# EAGLE design Baseboard_RP2040 (EAGLE 9.5.2)
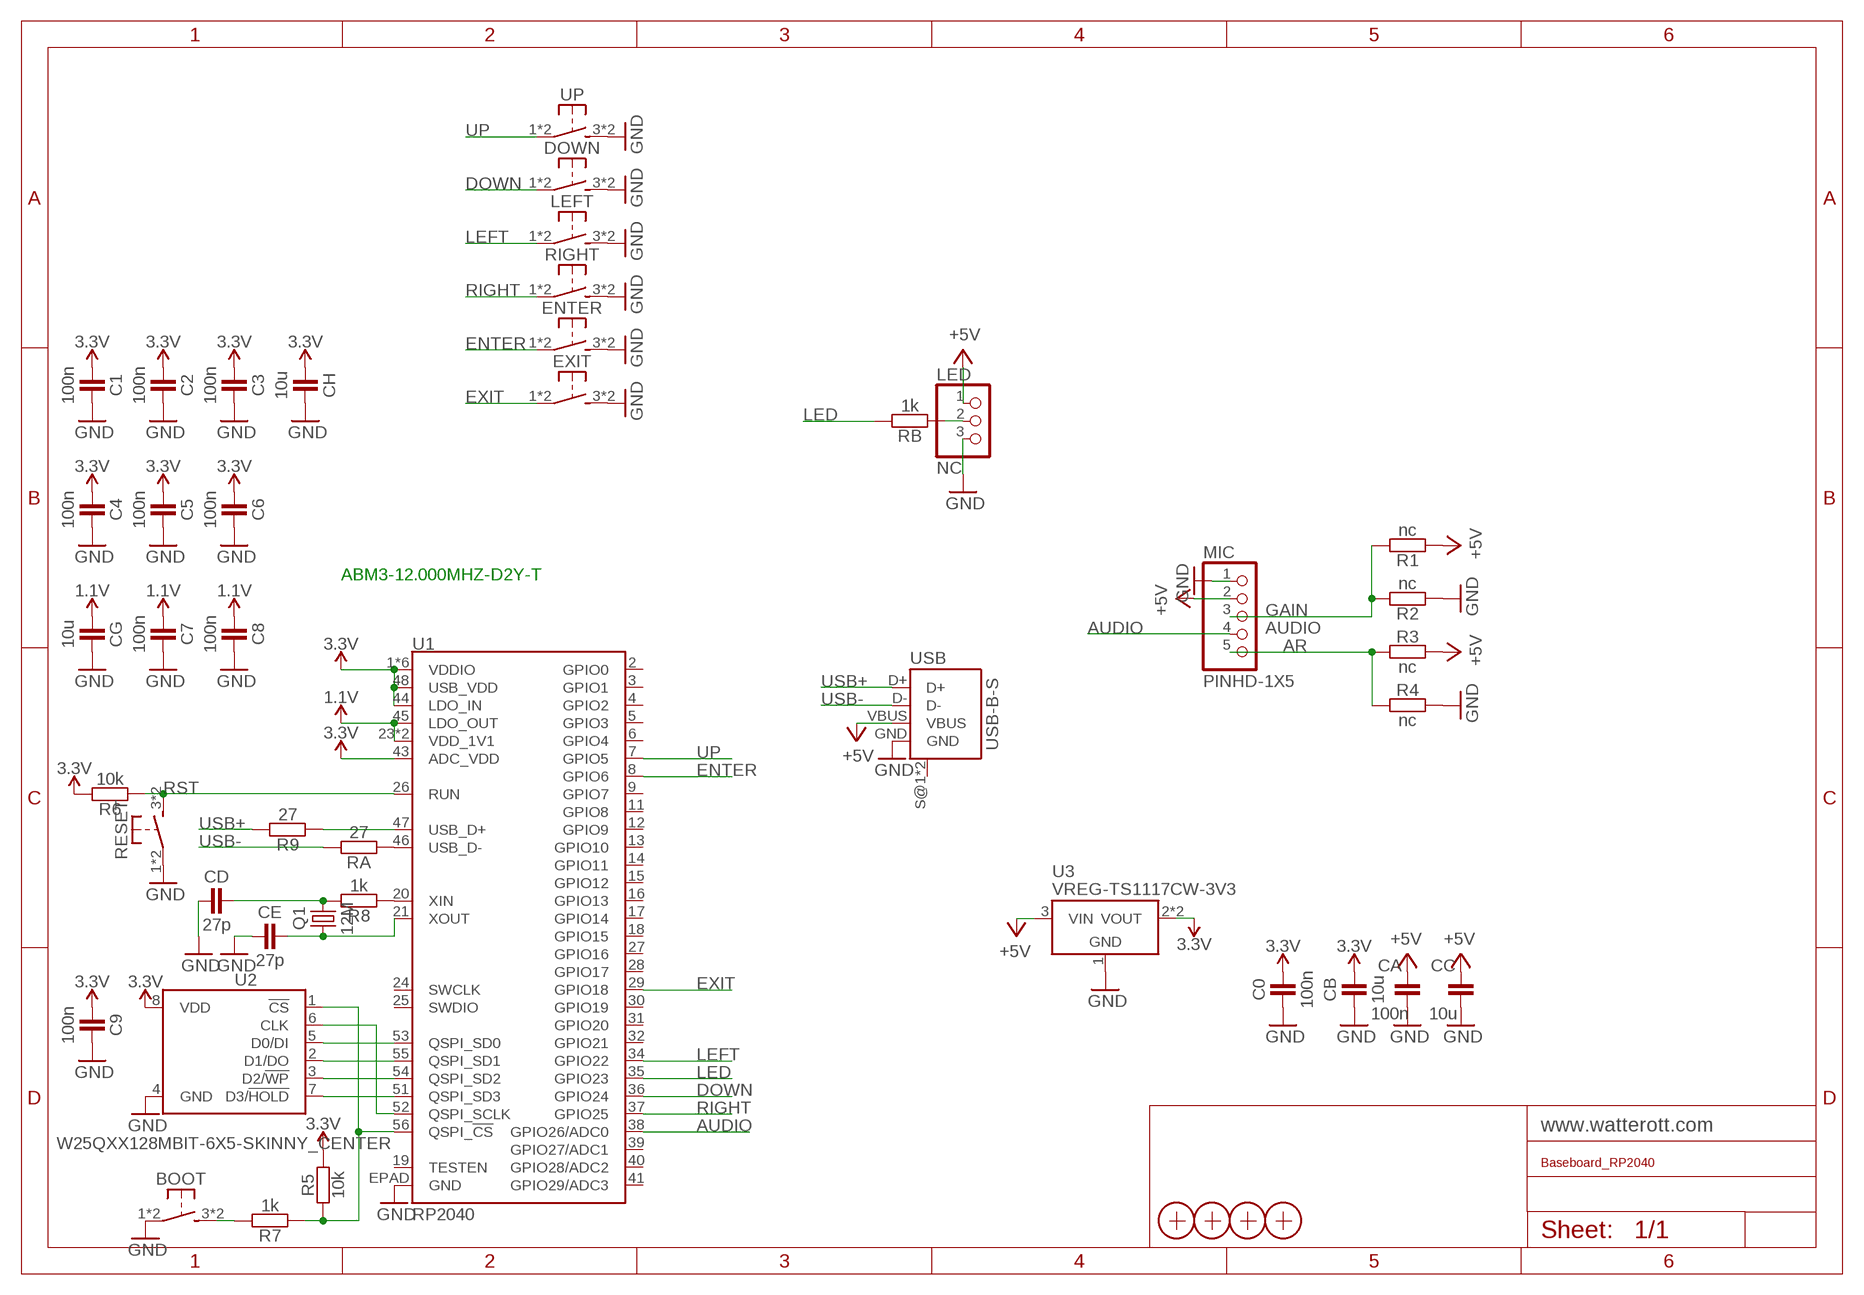
[diagram p0: schematic, sheet 1]

## Parts
BOOT  SW-TACTILE-6X6_SMD  [SW6X6_SMD]
C0  100n  CAPACITOR-0603  [C0603]
C1  100n  CAPACITOR-0603  [C0603]
C2  100n  CAPACITOR-0603  [C0603]
C3  100n  CAPACITOR-0603  [C0603]
C4  100n  CAPACITOR-0603  [C0603]
C5  100n  CAPACITOR-0603  [C0603]
C6  100n  CAPACITOR-0603  [C0603]
C7  100n  CAPACITOR-0603  [C0603]
C8  100n  CAPACITOR-0603  [C0603]
C9  100n  CAPACITOR-0603  [C0603]
CA  100n  CAPACITOR-0603  [C0603]
CB  10u  CAPACITOR-0603  [C0603]
CC  10u  CAPACITOR-0603  [C0603]
CD  27p  CAPACITOR-0603  [C0603]
CE  27p  CAPACITOR-0603  [C0603]
CG  10u  CAPACITOR-0603  [C0603]
CH  10u  CAPACITOR-0603  [C0603]
DOWN  SW-TACTILE-6X6_SMD  [SW6X6_SMD]
ENTER  SW-TACTILE-6X6_SMD  [SW6X6_SMD]
EXIT  SW-TACTILE-6X6_SMD  [SW6X6_SMD]
LED  NC  PINHD-1X3  [1X03]
LEFT  SW-TACTILE-6X6_SMD  [SW6X6_SMD]
MIC  PINHD-1X5  [1X05]
Q1  12M  CRYSTAL-CC2  [CRYSTAL_CC2]
R1  nc  RESISTOR-0603  [C0603]
R2  nc  RESISTOR-0603  [C0603]
R3  nc  RESISTOR-0603  [C0603]
R4  nc  RESISTOR-0603  [C0603]
R5  10k  RESISTOR-0603  [C0603]
R6  10k  RESISTOR-0603  [C0603]
R7  1k  RESISTOR-0603  [C0603]
R8  1k  RESISTOR-0603  [C0603]
R9  27  RESISTOR-0603  [C0603]
RA  27  RESISTOR-0603  [C0603]
RB  1k  RESISTOR-0603  [C0603]
RESET  SW-TACTILE-6X6_SMD  [SW6X6_SMD]
RIGHT  SW-TACTILE-6X6_SMD  [SW6X6_SMD]
U1  RP2040  [QFN-56]
U2  W25QXX128MBIT-6X5-SKINNY_CENTER  [WSON-8-6X5-SKINNY_CENTERPAD]
U3  VREG-TS1117CW-3V3  [SOT223]
UP  SW-TACTILE-6X6_SMD  [SW6X6_SMD]
USB  USB-B-S  [USB-B-S]
X1  PASSER-07  [PASSER_07MM]
X2  PASSER-07  [PASSER_07MM]
X3  PASSER-07  [PASSER_07MM]
X4  PASSER-07  [PASSER_07MM]

## Nets
1.1V: C7.1 C8.1 CG.1 U1.23(VDD_1V1) U1.45(LDO_OUT) U1.50(VDD_1V1)
3.3V: C0.2 C1.1 C2.1 C3.1 C4.1 C5.1 C6.1 C9.1 CB.2 CH.1 R5.2 R6.2 U1.1(VDDIO) U1.10(VDDIO) U1.22(VDDIO) U1.33(VDDIO) U1.42(VDDIO) U1.43(ADC_VDD) U1.44(LDO_IN) U1.48(USB_VDD) U1.49(VDDIO) U2.8(VDD) U3.2(VOUT) U3.4(VOUT)
+5V: CA.2 CC.2 LED.1 MIC.2 R1.1 R3.2 U3.3(VIN) USB.VBUS
AR: MIC.5 R3.1 R4.1
AUDIO: MIC.4 U1.38(GPIO26/ADC0)
DOWN: DOWN.1 DOWN.2(P1) U1.36(GPIO24)
ENTER: ENTER.1 ENTER.2(P1) U1.8(GPIO6)
EXIT: EXIT.1 EXIT.2(P1) U1.29(GPIO18)
GAIN: MIC.3 R1.2 R2.2
GND: BOOT.1 BOOT.2(P1) C0.1 C1.2 C2.2 C3.2 C4.2 C5.2 C6.2 C7.2 C8.2 C9.2 CA.1 CB.1 CC.1 CD.1 CE.1 CG.2 CH.2 DOWN.3(S1) DOWN.4(S1) ENTER.3(S1) ENTER.4(S1) EXIT.3(S1) EXIT.4(S1) LED.3 LEFT.3(S1) LEFT.4(S1) MIC.1 R2.1 R4.2 RESET.1 RESET.2(P1) RIGHT.3(S1) RIGHT.4(S1) U1.EPAD(GND) U2.4(GND) U3.1(GND) UP.3(S1) UP.4(S1) USB.GND
LED: RB.2 U1.35(GPIO23)
LEFT: LEFT.1 LEFT.2(P1) U1.34(GPIO22)
N$16: LED.2 RB.1
N$17: U1.53(QSPI_SD0) U2.5(D0/DI)
N$18: U1.55(QSPI_SD1) U2.2(D1/DO)
N$19: U1.54(QSPI_SD2) U2.3(D2/!WP!)
N$20: U1.51(QSPI_SD3) U2.7(D3/!HOLD!)
N$21: U1.52(QSPI_SCLK) U2.6(CLK)
N$22: R5.1 R7.1 U1.56(QSPI_!CS!) U2.1(!CS!)
N$23: BOOT.3(S1) BOOT.4(S1) R7.2
N$24: R8.1 U1.20(XIN)
N$25: CD.2 Q1.2 R8.2
N$26: CE.2 Q1.1 U1.21(XOUT)
N$28: R9.1 U1.47(USB_D+)
N$29: RA.1 U1.46(USB_D-)
RIGHT: RIGHT.1 RIGHT.2(P1) U1.37(GPIO25)
RST: R6.1 RESET.3(S1) RESET.4(S1) U1.26(RUN)
UP: U1.7(GPIO5) UP.1 UP.2(P1)
USB+: R9.2 USB.D+
USB-: RA.2 USB.D-
Unconnected: U1.2(GPIO0) U1.3(GPIO1) U1.4(GPIO2) U1.5(GPIO3) U1.6(GPIO4) U1.9(GPIO7) U1.11(GPIO8) U1.12(GPIO9) U1.13(GPIO10) U1.14(GPIO11) U1.15(GPIO12) U1.16(GPIO13) U1.17(GPIO14) U1.18(GPIO15) U1.19(TESTEN) U1.24(SWCLK) U1.25(SWDIO) U1.27(GPIO16) U1.28(GPIO17) U1.30(GPIO19) U1.31(GPIO20) U1.32(GPIO21) U1.39(GPIO27/ADC1) U1.40(GPIO28/ADC2) U1.41(GPIO29/ADC3) USB.S@1(SHIELD) USB.S@2(SHIELD)

## Notes on the sheet
- ABM3-12.000MHZ-D2Y-T

## Library data of the parts
BOOT DOWN ENTER EXIT LEFT RESET RIGHT UP = we-switch:SW-TACTILE: Tactile Switche
C0 C1-C9 CA CB CC CD CE CG CH = we-rcl:CAPACITOR: Capacitor ...2.2uF @ 6.3V -> 0402 ...4.7uF @ 6.3V -> 0603 ...10uF @ 16V -> 0805 ...22uF @ 25V -> 1206
LED = Connector:PINHD-1X3: PIN HEADER; CATEGORY: CONNECTOR; SUB-CATEGORY: PIN-HEADER
MIC = Connector:PINHD-1X5: PIN HEADER; CATEGORY: CONNECTOR; SUB-CATEGORY: PIN-HEADER
Q1 = we-rcl:CRYSTAL: Crystal
R1-R9 RA RB = we-rcl:RESISTOR: Resistor all kinds in 0402 and 0603
U1 = SparkFun-IC-Microcontroller:RP2040: Raspberry Pi RP2040 MCU 56-pin 32-bit Microcontroller with 264kB of SRAM and external flash support up to 16MB Getting Started with the RP2040 <https://pico.raspberrypi.org/getting-started/> Dual-core ARM Cortex M0+ processor, flexible clock running up to 133 MHz 264kB of SRAM, and QSPI control of common flash memory USB 1.1 Host and Device support Low-power sleep and dormant modes Drag & drop programming using mass storage over USB 26 multi-function GPIO pins 2×SPI, 2×I2C, 2×UART, 3×12-bit ADC, 16×controllable PWM channels Accurate clock and timer on-chip Temperature sensor Accelerated floating point libraries on-chip 8×Programmable IO (PIO) state machines for custom peripheral support; PROD_ID: IC-15502
U2 = SparkFun-IC-Memory:W25QXX; PROD_ID: IC-15107
U3 = we-power:VREG: Voltage Regulator LDOs Taiwan Semi TS1117 800mA max 15V - compatible On Semi NCP1117 1A max 20V - compatible Diodes AP2111H 0.6A max 6V (0.25V@0.6A) - compatible Diodes AP2114H 1A max 6V (0.45V@1A) Taiwan Semi TS9011 250mA max 12V - compatible Diodes AP2210 300mA max 15V - compatible Microchip MCP1700 250mA max 6.5V - compatible Microchip MCP1702 250mA max 13V - compatible Microchip MCP1703 250mA max 16V - compatible Microchip MCP1754 150mA max 16V Taiwan Semi TS5204 80mA max 16V (low noise) DC/DC Converter Modules Recom R-78Ex.x-1.0-W36 1A max 28V - compatible CUI V78xx-2000 2A max 18V Murata OKI-78SR-x.x/1.5-W36 1.5A max 36V
USB = we-con:USB: USB Connector
X1-X4 = we-symbol:PASSER: Fiducial Marker

## Board
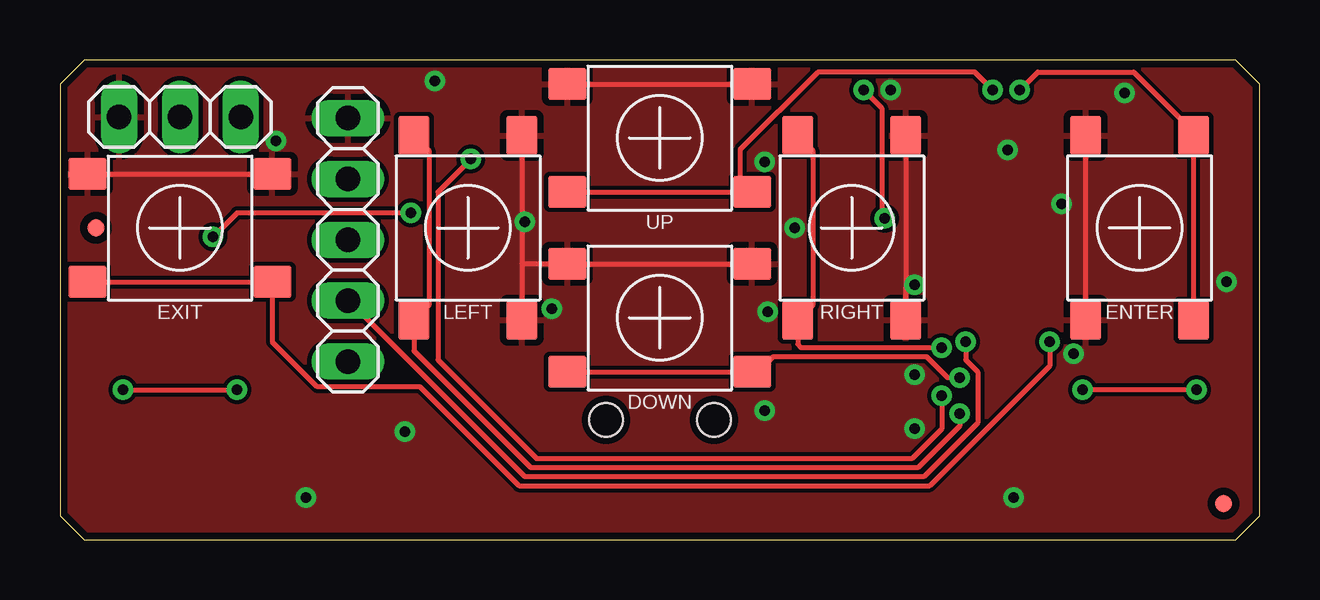
[diagram p1: board, top side]
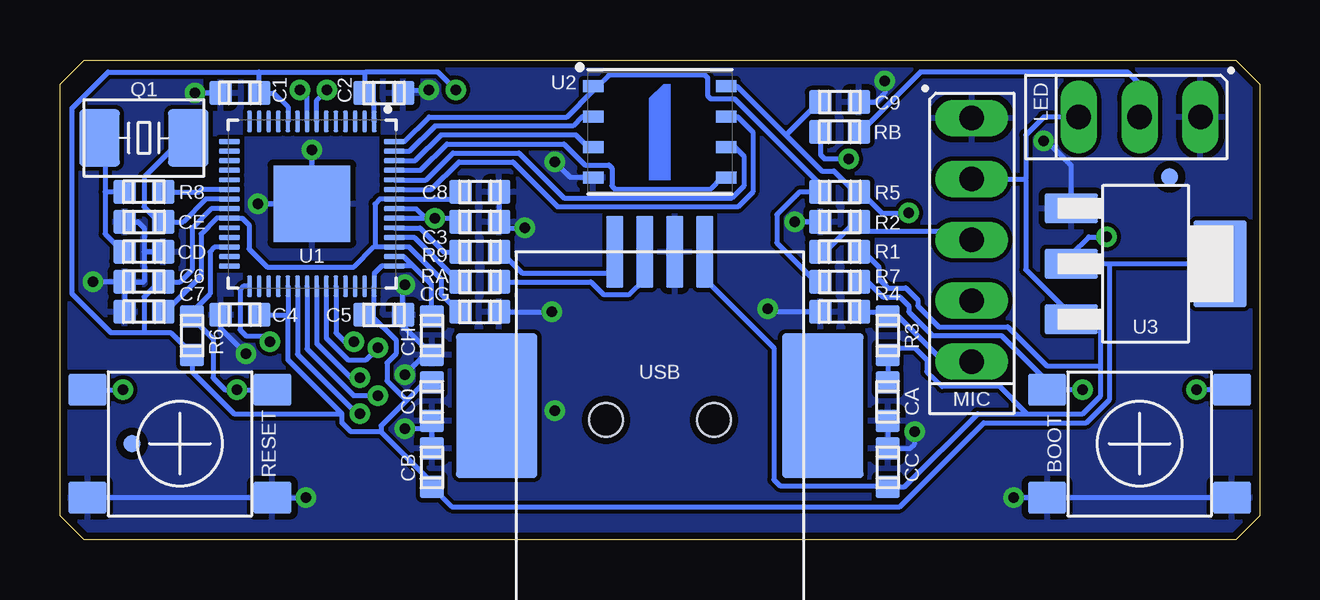
[diagram p2: board, bottom side, seen from below]

Size 50 x 20 mm. Coordinates in mm from the lower left corner, seen from the top.
Outline: 0,1 1,0 49,0 50,1 50,19 49,20 1,20 0,19 0,1
Copper layers (1*16): Top 0.035mm / dielectric 1.5mm / Bottom 0.035mm
Design rules "aisler_2_layer_simple": minimum track width 0.2mm, minimum drill 0.45mm, track to track 0.175mm, track to pad 0.175mm, pad to pad 0.175mm, via to via 0.175mm, smd to smd 0.175mm, copper to edge 0.3mm, drill to drill 0.25mm, minimum pad ring 0.2mm, minimum via ring 0.2mm, stop-mask expansion 0mil, vias tented up to drill 0mil, thermal gap 10mil

### Footprints (pad centres in the part's own frame; a part is rotated, then mirrored left to right if it is on the bottom)
SW6X6_SMD = smd 1.6 x 1.3: 1 -3.85,2.25; 2 3.85,2.25; 3 -3.85,-2.25; 4 3.85,-2.25
C0603 = smd 1 x 0.95: 1 0,0.8; 2 0,-0.8
1X03 = drill 1.016 long: 1 -2.54,0; 2 0,0; 3 2.54,0
1X05 = drill 1.016 long: 1 -5.08,0; 2 -2.54,0; 3 0,0; 4 2.54,0; 5 5.08,0
CRYSTAL_CC2 = smd 2.4 x 1.7: 1 0,1.85; 2 0,-1.85
QFN-56 = smd 0.875 x 0.2: 1 -3.437,2.6; 2 -3.437,2.2; 3 -3.437,1.8; 4 -3.437,1.4; 5 -3.437,1; 6 -3.437,0.6; 7 -3.437,0.2; 8 -3.437,-0.2; 9 -3.437,-0.6; 10 -3.437,-1; 11 -3.437,-1.4; 12 -3.437,-1.8; 13 -3.437,-2.2; 14 -3.437,-2.6; 29 3.437,-2.6; 30 3.437,-2.2; 31 3.437,-1.8; 32 3.437,-1.4; 33 3.437,-1; 34 3.437,-0.6; 35 3.437,-0.2; 36 3.437,0.2; 37 3.437,0.6; 38 3.437,1; 39 3.437,1.4; 40 3.437,1.8; 41 3.437,2.2; 42 3.437,2.6 | smd 0.2 x 0.875: 15 -2.6,-3.437; 16 -2.2,-3.437; 17 -1.8,-3.437; 18 -1.4,-3.437; 19 -1,-3.437; 20 -0.6,-3.437; 21 -0.2,-3.437; 22 0.2,-3.437; 23 0.6,-3.437; 24 1,-3.437; 25 1.4,-3.437; 26 1.8,-3.437; 27 2.2,-3.437; 28 2.6,-3.437; 43 2.6,3.437; 44 2.2,3.437; 45 1.8,3.437; 46 1.4,3.437; 47 1,3.437; 48 0.6,3.437; 49 0.2,3.437; 50 -0.2,3.437; 51 -0.6,3.437; 52 -1,3.437; 53 -1.4,3.437; 54 -1.8,3.437; 55 -2.2,3.437; 56 -2.6,3.437 | smd 3.2 x 3.2: EPAD 0,0
WSON-8-6X5-SKINNY_CENTERPAD = smd 0.85 x 0.5: 1 -2.775,1.905; 2 -2.775,0.635; 3 -2.775,-0.635; 4 -2.775,-1.905; 5 2.775,-1.905; 6 2.775,-0.635; 7 2.775,0.635; 8 2.775,1.905
SOT223 = smd 2.235 x 1.219: 1 -3.099,2.311; 2 -3.099,0; 3 -3.099,-2.311 | smd 2.2 x 3.6: 4 3.099,0
USB-B-S = smd 3 x 0.7: D+ -7,-1.875; D- -7,-0.625; GND -7,0.625; VBUS -7,1.875 | smd 6.04 x 3.4: S@1 -0.58,6.8; S@2 -0.58,-6.8 | hole 1.4: 0,-2.25; 0,2.25
PASSER_07MM = smd 0.7 x 0.7: X 0,0

### Placement (x,y rotation side)
BOOT  5,4 180 bottom
C0  34.5,5.75 180 bottom
C1  42.5,18.62 270 bottom
C2  36.5,18.62 90 bottom
C3  32.5,13.25 90 bottom
C4  42.5,9.38 270 bottom
C5  36.5,9.38 90 bottom
C6  46.5,10.75 270 bottom
C7  46.5,9.5 270 bottom
C8  32.5,14.5 90 bottom
C9  17.5,18.25 90 bottom
CA  15.5,5.75 180 bottom
CB  34.5,3 0 bottom
CC  15.5,3 0 bottom
CD  46.5,12 270 bottom
CE  46.5,13.25 90 bottom
CG  32.5,9.5 90 bottom
CH  34.5,8.5 0 bottom
DOWN  25,9.25 180 top
ENTER  45,13 270 top
EXIT  5,13 180 top
LED  5,17.62 180 top
LEFT  17,13 90 top
MIC  12,12.5 270 top
Q1  46.5,16.75 270 bottom
R1  17.5,12 270 bottom
R2  17.5,13.25 90 bottom
R3  15.5,8.5 0 bottom
R4  17.5,9.5 270 bottom
R5  17.5,14.5 90 bottom
R6  44.5,8.5 0 bottom
R7  17.5,10.75 90 bottom
R8  46.5,14.5 270 bottom
R9  32.5,12 90 bottom
RA  32.5,10.75 90 bottom
RB  17.5,17 270 bottom
RESET  45,4 180 bottom
RIGHT  33,13 90 top
U1  39.5,14 270 bottom
U2  25,17 0 bottom
U3  4.75,11.5 0 bottom
UP  25,16.75 180 top
USB  25,5 270 bottom
X1  3.75,15.12 180 bottom
X2  47,4 180 bottom
X3  1.5,13 0 top
X4  48.5,1.5 0 top

### Tracks (layer width: path | path; a pad name or v marks a point on that pad's centre or on a via)
1.1V
  Bottom 0.2: CG.1 33.38,9.5 34.12,10.25 34.12,10.88 35.45,12.2 U1.45 36.92,12.2 | C8.1 33.42,14.5 33.73,14.2 U1.50 36.67,14.2 36.88,14 36.88,12.25 36.92,12.2 | C7.1 45.62,9.5 44.12,11 44.12,12.75 43.48,13.4 U1.23 42.4,13.4 42.12,13.12 42.12,12.12 41.38,11.38 37.75,11.38 36.92,12.2
3.3V  (via drill 0.45)
  Top 0.2: v14.62,13.62 7.38,13.62 v6.38,12.62 | v34.38,13.4 34.25,13.52 34.25,18 v33.5,18.75
  Bottom 0.2: 35.27,11.4 U1.43 36.6,11.4 36.9,11.1 U1.42 36.9,9.78 C5.1 37.05,9.38 36,8.32 36,7.75 36.38,7.38 36.38,6.62 35.56,5.81 | 35.27,11.4 34.54,10.66 34.54,9.62 | 34.54,9.62 34.54,9.34 | U1.48 34.75,13.4 | C3.1 33.45,13.4 v34.38,13.4 34.75,13.4 | 36.9,17.55 U1.1 36.9,18.23 C2.1 37.3,19.45 37.25,19.5 | C1.1 41.08,18.62 40.5,18.05 U1.10 | U1.22 43.7,13.8 44.5,13 44.5,11.25 45,10.75 C6.1 45.88,10.75 46.5,10.12 46.5,8.62 | R6.2 44.58,7.62 | C4.1 40.5,9.38 | 34.75,9.38 34.66,9.46 CH.1 34.5,9.59 34.54,9.62 | R6.2 44.5,7 42.75,5.25 38.25,5.25 | R6.2 44.5,7.75 45.38,8.62 46.5,8.62 | C0.2 34.83,6.55 35.56,5.81 | 35.56,5.81 36.62,4.75 36.62,4.5 | U1.33 40.5,9.38 | 19.75,16.88 21.78,18.91 U2.8 | 19.75,16.88 18.25,15.38 17.75,15.38 16.88,14.5 R5.2 16.62,14.5 15.75,13.62 v14.62,13.62 | 36.62,4.5 34.5,2.38 CB.2 33.67,1.38 15,1.38 11.5,4.88 7.22,4.88 6.25,5.85 6.25,11.5 | C1.1 41.7,18.68 | U3.4 6.25,11.5 | 6.25,11.5 U3.2 7.85,11.9 7.12,12.62 v6.38,12.62 | U1.49 35.15,13.8 34.75,13.4 | U1.44 35.67,11.8 35.27,11.4 | 41.7,19.5 48,19.5 49.5,18 49.5,10.25 47.88,8.62 46.5,8.62 | 41.7,19.5 37.25,19.5 | C9.1 18.38,18.25 19.75,16.88 | v33.5,18.75 34.25,19.5 37.25,19.5 | 36.62,4.5 37.88,4.5 38.25,4.88 38.25,5.25 | 38.25,5.25 40.5,7.5 40.5,9.38 | C1.1 41.7,19.5
+5V
  Bottom 0.2: 15.25,6.3 CA.2 R3.2 15.5,7.88 15.38,8 14.38,8 13.88,7.5 13.88,7 13.22,6.38 10.83,6.38 9.7,5.25 | R1.1 16.5,12 15.88,11.38 15.88,10.88 15.5,10.5 14.75,10.5 14.25,10 14.25,9.75 13.38,8.88 10.5,8.88 8.88,7.25 6.62,7.25 | 9.7,5.25 11.75,5.25 14.8,2.2 CC.2 15.55,2.25 20,2.25 20.25,2.5 20.25,8 23.12,10.88 USB.VBUS | 9.7,5.25 7.38,5.25 6.62,6 6.62,7.25 | 6.62,7.25 6.62,9.19 U3.3 7.69,9.19 9.75,11.25 9.75,15 9.79,15.04 | MIC.2 9.79,15.04 | 9.79,15.04 9.75,15.04 9.75,16.88 9,17.62 LED.1
AR
  Bottom 0.2: R4.1 15.3,9.5 | 15.3,9.5 R3.1 | MIC.5 13.17,7.42 15.25,9.5 15.3,9.5
AUDIO  (via drill 0.45)
  Top 0.2: MIC.4 12.04,9.96 19.38,2.62 36,2.62 38.25,4.88 38.25,7 37.75,7.5 v37.75,8.25
  Bottom 0.2: U1.38 38.5,8.62 38.12,8.25 v37.75,8.25
DOWN  (via drill 0.45)
  Top 0.2: v37.5,6.75 37,6.75 36.12,7.62 29.73,7.62 29.1,7 DOWN.1 DOWN.2
  Bottom 0.2: v37.5,6.75 37.88,6.75 39.3,8.18 U1.36
ENTER  (via drill 0.45)
  Top 0.2: ENTER.2 ENTER.1 47.25,17 44.75,19.5 40.75,19.5 v40,18.75
  Bottom 0.2: U1.8 39.7,18.45 v40,18.75
EXIT  (via drill 0.45)
  Top 0.2: v41.25,8.25 41.25,7.25 36.25,2.25 19.12,2.25 15,6.38 10.72,6.38 8.85,8.25 EXIT.1 8.85,10.5 8.6,10.75 EXIT.2
  Bottom 0.2: U1.29 42.35,10.56 42.5,10.41 42.5,8.75 42.25,8.5 41.5,8.5 v41.25,8.25
GAIN
  Bottom 0.2: MIC.3 12.38,12.88 16.32,12.88 R2.2 16.88,13.25 18.12,12 R1.2
GND  (via drill 0.45)
  Top 0.2: DOWN.3 DOWN.4 19.25,11.5 | LEFT.4 19.25,13.25 v19.38,13.25 | 19.25,13.12 19.25,11.5 | 19.25,11.5 LEFT.3 | UP.4 UP.3 | RIGHT.4 RIGHT.3 35.25,10.5 35.38,10.62 v35.62,10.62 | ENTER.4 ENTER.3 | EXIT.4 EXIT.3
  Bottom 0.2: CE.1 46.75,13.25 46.5,13 46.5,12 | 46.5,12 46.5,10.75 C6.2 | C6.2 C7.2 | CB.1 C0.1 34.5,4.62 v35.62,4.62 | CA.1 CC.1 14.57,3.8 14.38,4 v14.38,4.5 | CD.1 46.5,12 | RESET.2 RESET.1 v39.75,1.75 39.88,1.75 | BOOT.1 BOOT.2 v10.25,1.75 | C8.2 C3.2 31.45,13 v30.62,13 | C6.2 v48.62,10.75 | C4.2 43.3,8.8 v42.25,7.75 | C1.2 v44.38,18.62 | CG.2 v29.5,9.5 | C2.2 35.58,18.75 v34.62,18.75 | v39.5,16.25 U1.EPAD v41.75,14 | R4.2 20.38,9.5 v20.5,9.62 | R2.1 v19.38,13.25 | C9.2 16,18.25 15.62,18.62 v15.62,19.12 | U2.4 28.72,15.09 v29.38,15.75 | U3.1 7.85,15.6 8.88,16.62 v9,16.62 | 35.66,6.84 34.8,7.7 CH.2 35.7,8.9 C5.2 35.75,9.43 35.75,10.5 v35.62,10.62
  other vias: 35.62,6.88 29.38,5.38
  pour Bottom: 0,20 50,20 50,0 0,0
  pour Top: 0,20 0,0 50,0 50,20
LED  (via drill 0.45)
  Top 0.2: v17.12,15.88 15.75,14.5 15.75,7.5 19.88,3.38 35.5,3.38 36.75,4.62 v36.75,6
  Bottom 0.2: RB.2 18.3,16.05 18.12,15.88 v17.12,15.88 | U1.35 39.7,7.95 37.75,6 v36.75,6
LEFT  (via drill 0.45)
  Top 0.2: LEFT.2 15.38,16.23 15.38,9.78 LEFT.1 14.75,7.88 19.62,3 35.75,3 37.5,4.75 v37.5,5.25
  Bottom 0.2: U1.34 40.1,7.72 37.62,5.25 v37.5,5.25
N$16
  Bottom 0.2: LED.2 5,19 5.5,19.5 14.14,19.5 16.64,17 RB.1
N$17
  Bottom 0.2: U1.53 34.98,15.4 33.88,16.5 29,16.5 28.12,15.62 27.12,15.62 27,15.5 27,14.75 26.88,14.62 22.88,14.62 22.41,15.09 U2.5
N$18
  Bottom 0.2: U1.55 35.42,16.2 34.38,17.25 28.62,17.25 28.24,17.64 U2.2
N$19
  Bottom 0.2: U1.54 35.2,15.8 34.12,16.88 28.5,16.88 27.99,16.36 U2.3
N$20
  Bottom 0.2: U1.51 34.52,14.6 33.38,15.75 31.12,15.75 29.25,13.88 21.75,13.88 21.12,14.5 21.12,17 21.76,17.64 U2.7
N$21
  Bottom 0.2: U1.52 34.75,15 33.62,16.12 30.88,16.12 29,14.25 22,14.25 21.5,14.75 21.5,16 21.86,16.36 U2.6
N$22
  Bottom 0.2: U1.56 35.65,16.6 34.62,17.62 28.88,17.62 27.77,18.73 U2.1 27.59,18.91 27.12,19.38 23.12,19.38 23,19.25 23,18.5 22.88,18.38 21.88,18.38 18.3,14.8 R5.1 19.18,14.5 20.12,13.55 20.12,12.38 18.5,10.75 R7.1
N$23  (via drill 0.45)
  Top 0.2: v2.62,6.25 v7.38,6.25
  Bottom 0.2: R7.2 16.32,10.75 15.7,10.12 15,10.12 14.62,9.75 14.62,9.5 13.62,8.5 10.75,8.5 8.85,6.6 BOOT.4 v7.38,6.25 | BOOT.3 v2.62,6.25
N$24
  Bottom 0.2: U1.20 44.1,14.6 44.2,14.5 R8.1
N$25
  Bottom 0.2: CD.2 47.38,12 48.12,12.75 48.12,14.5 | Q1.2 48.12,16.52 48.12,14.5 | R8.2 48.12,14.5
N$26
  Bottom 0.2: U1.21 43.92,14.2 44.88,13.25 CE.2 45.88,13.25 46.5,13.88 46.5,15.12 44.88,16.75 Q1.1
N$28
  Bottom 0.2: U1.47 35,13 34,12 R9.1
N$29
  Bottom 0.2: RA.1 33.38,10.75 35.23,12.6 U1.46
RIGHT  (via drill 0.45)
  Top 0.2: v36.75,8 30.9,8 30.75,8.15 RIGHT.1 31.38,9.78 31.38,16.23 RIGHT.2
  Bottom 0.2: U1.37 38.9,8.4 38,7.5 37.25,7.5 v36.75,8
RST  (via drill 0.45)
  Top 0.2: v47.38,6.25 v42.62,6.25
  Bottom 0.2: U1.26 43.55,12.2 43.75,12 43.75,10.25 44.5,9.5 R6.1 | R6.1 44.5,9 | R6.1 44.5,9.25 43.62,8.38 43.62,6.75 43.12,6.25 v42.62,6.25 RESET.3 | RESET.4 v47.38,6.25
UP  (via drill 0.45)
  Top 0.2: UP.2 UP.1 28.35,15 28.35,16.25 31.6,19.5 38.12,19.5 v38.88,18.75
  Bottom 0.2: U1.7 39.3,18.32 v38.88,18.75
USB+
  Bottom 0.2: USB.D+ 26.88,11.12 30.75,11.12 31.62,12 R9.2
USB-
  Bottom 0.2: RA.2 27.88,10.75 27.35,10.22 26.27,10.22 25.62,10.88 USB.D-

### Text on the board
bNames: MIC